# Altium schematic sheet 4_Filters.SCHDOC
size 297 x 209 mm; SheetNumber: 14; SheetTotal: 18; DocumentName: 4_Filters.SCHDOC
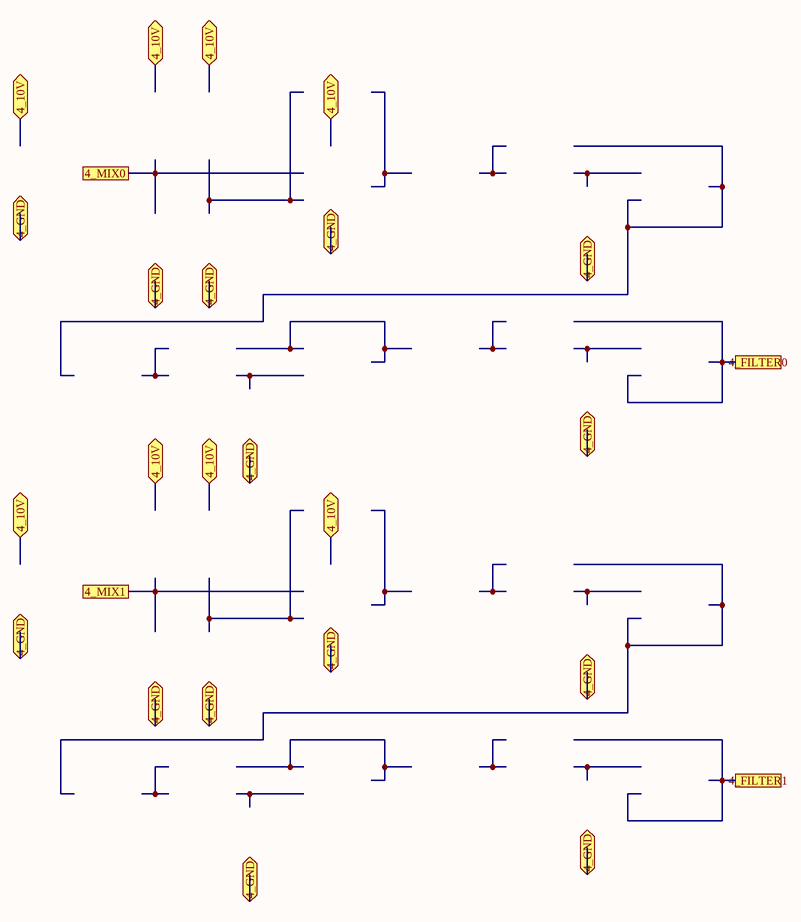
[diagram p0: 4_Filters.SCHDOC]

## Ports
4_10V, 4_FILTER0, 4_FILTER1, 4_GND, 4_MIX0, 4_MIX1

## Notes on the sheet
- A
- B
- C
- D
- 1
- 2
- 3
- Title
- 4
- Size
- A4
- Number
- Rev
- Date
- Filename
- Drawn by
- Sheet
- of